# EAGLE design ueproj (EAGLE 8.2.1)
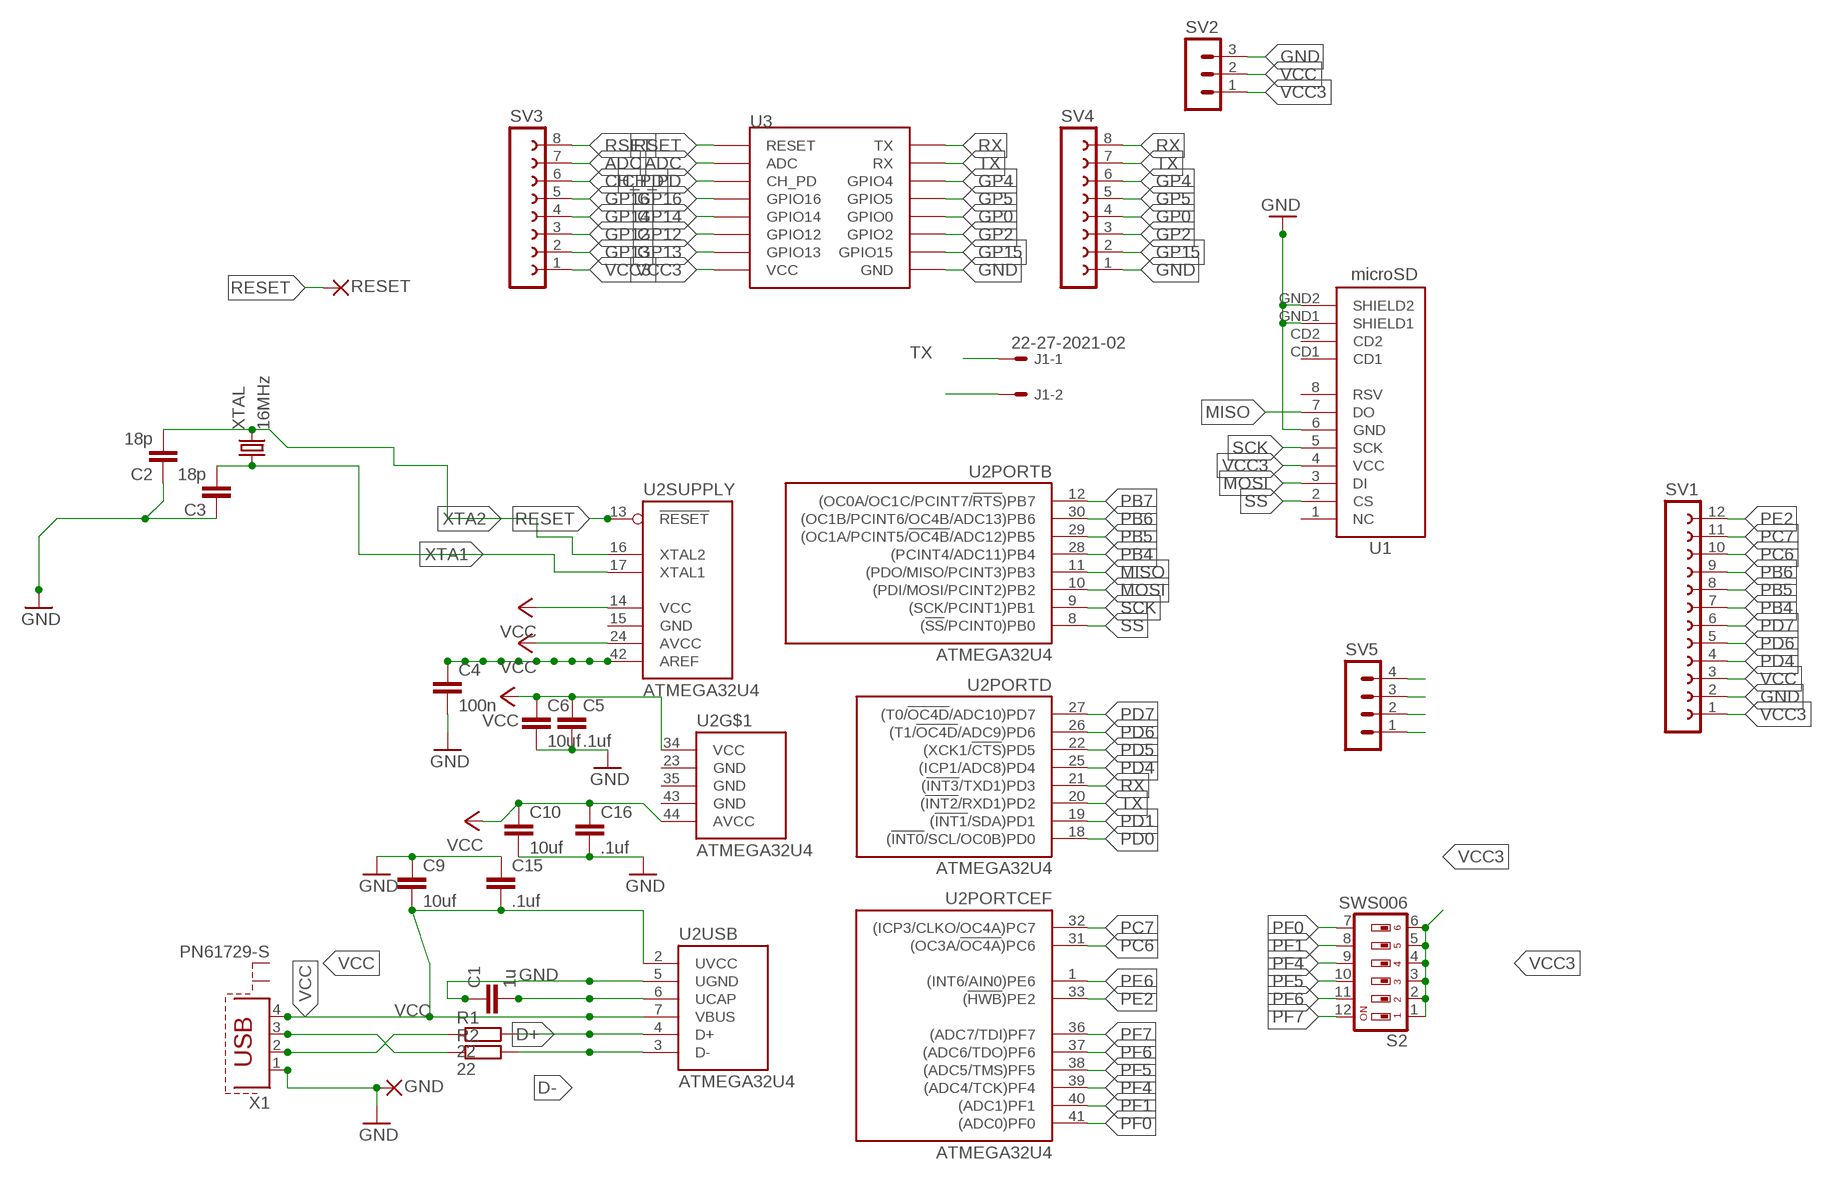
[diagram p0: schematic, sheet 1]

## Parts
C1  1u  C-EUC0603  [C0603]
C2  18p  C-EUC0603  [C0603]
C3  18p  C-EUC0603  [C0603]
C4  100n  C-EUC0603  [C0603]
C5  .1uf  C-EUC0603  [C0603]
C6  10uf  C2.5/2  [C2.5-2]
C9  10uf  C-EUC0603  [C0603]
C10  10uf  C2.5/2  [C2.5-2]
C15  .1uf  C-EUC0603  [C0603]
C16  .1uf  C-EUC0603  [C0603]
GND  WIREPAD2,15/1,0-NOPLACE  [2,15/1,0-NOPLACE]
J1  22-27-2021-02  [6410-02]
R1  22  R-EU_R0603  [R0603]
R2  22  R-EU_R0603  [R0603]
RESET  WIREPAD2,15/1,0-NOPLACE  [2,15/1,0-NOPLACE]
S2  SWS006  [SMS-006]
SV1  FE12-1  [FE12]
SV2  MA03-1  [MA03-1]
SV3  FE08-1  [FE08]
SV4  FE08-1  [FE08]
SV5  MA04-1  [MA04-1]
U1  microSD  USD-SOCKETSMD  [MICRO-SD-SOCKET-PP]
U2  ATMEGA32U4  ATMEGAXU4TQFP44  [TQFP44]
U3  ESP12SMD  [ESP12-SMD]
X1  PN61729-S  [PN61729-S]
XTAL  16MHz  CRYSTALABM7  [ABM7]

## Nets
ADC: SV3.7 U3.ADC
AREF: C4.1 U2.42(SUPPLY:AREF)
CH_PD: SV3.6 U3.CH_PD
D+: R1.2 U2.4(USB:D+)
D-: R2.2 U2.3(USB:D-)
GND: C1.1 C2.1 C3.1 C4.2 C10.2 C16.2 GND.1(P) SV1.2 SV2.3 SV4.1 U1.6(GND) U1.GND1(SHIELD1) U1.GND2(SHIELD2) U2.5(USB:UGND) U3.GND X1.1
GP0: SV4.4 U3.GPIO0
GP2: SV4.3 U3.GPIO2
GP4: SV4.6 U3.GPIO4
GP5: SV4.5 U3.GPIO5
GP12: SV3.3 U3.GPIO12
GP13: SV3.2 U3.GPIO13
GP14: SV3.4 U3.GPIO14
GP15: SV4.2 U3.GPIO15
GP16: SV3.5 U3.GPIO16
MISO: SV5.4 U1.7(DO) U2.11(PORTB:(PDO/MISO/PCINT3)PB3)
MOSI: SV5.2 U1.3(DI) U2.10(PORTB:(PDI/MOSI/PCINT2)PB2)
N$1: C9.1 C15.1
N$3: C5.2 C6.2
N$46: C1.2 U2.6(USB:UCAP)
N$74: R1.1 X1.2
N$75: R2.1 X1.3
PB4: SV1.7 U2.28(PORTB:(PCINT4/ADC11)PB4)
PB5: SV1.8 U2.29(PORTB:(OC1A/PCINT5/!OC4B!/ADC12)PB5)
PB6: SV1.9 U2.30(PORTB:(OC1B/PCINT6/OC4B/ADC13)PB6)
PB7: U2.12(PORTB:(OC0A/OC1C/PCINT7/!RTS!)PB7)
PC6: SV1.10 U2.31(PORTCEF:(OC3A/!OC4A!)PC6)
PC7: SV1.11 U2.32(PORTCEF:(ICP3/CLKO/OC4A)PC7)
PD0: U2.18(PORTD:(!INT0!/SCL/OC0B)PD0)
PD1: U2.19(PORTD:(!INT1!/SDA)PD1)
PD4: SV1.4 U2.25(PORTD:(ICP1/ADC8)PD4)
PD5: U2.22(PORTD:(XCK1/!CTS!)PD5)
PD6: SV1.5 U2.26(PORTD:(T1/!OC4D!/ADC9)PD6)
PD7: SV1.6 U2.27(PORTD:(T0/!OC4D!/ADC10)PD7)
PE2: SV1.12 U2.33(PORTCEF:(!HWB!)PE2)
PE6: U2.1(PORTCEF:(INT6/AIN0)PE6)
PF0: S2.7 U2.41(PORTCEF:(ADC0)PF0)
PF1: S2.8 U2.40(PORTCEF:(ADC1)PF1)
PF4: S2.9 U2.39(PORTCEF:(ADC4/TCK)PF4)
PF5: S2.10 U2.38(PORTCEF:(ADC5/TMS)PF5)
PF6: S2.11 U2.37(PORTCEF:(ADC6/TDO)PF6)
PF7: S2.12 U2.36(PORTCEF:(ADC7/TDI)PF7)
RESET: RESET.1(P) U2.13(SUPPLY:!RESET)
RSET: SV3.8 U3.RESET
RX: J1.2 SV4.8 U2.21(PORTD:(!INT3!/TXD1)PD3) U3.TXD0(TX)
SCK: SV5.3 U1.5(SCK) U2.9(PORTB:(SCK/PCINT1)PB1)
SS: SV5.1 U1.2(CS) U2.8(PORTB:(!SS!/PCINT0)PB0)
TX: J1.1 SV4.7 U2.20(PORTD:(!INT2!/RXD1)PD2) U3.RXD0(RX)
VCC: C5.1 C6.1 C9.2 C10.1 C15.2 C16.1 SV1.3 SV2.2 U2.2(USB:UVCC) U2.7(USB:VBUS) U2.14(SUPPLY:VCC) U2.24(SUPPLY:AVCC) U2.34(VCC) U2.44(AVCC) X1.4
VCC3: S2.1 S2.2 S2.3 S2.4 S2.5 S2.6 SV1.1 SV2.1 SV3.1 U1.4(VCC) U3.VCC
XTA1: C3.2 U2.17(SUPPLY:XTAL1) XTAL.P$1
XTA2: C2.2 U2.16(SUPPLY:XTAL2) XTAL.P$2
Unconnected: U1.1(NC) U1.8(RSV) U1.CD1 U1.CD2 X1.S1 X1.S2

## Power pins joined to a net without a drawn wire
GND: U2.15(SUPPLY:GND) U2.23(GND) U2.35(GND) U2.43(GND)

## Library data of the parts
C1-C5 C9 C15 C16 = rcl:C-EU: CAPACITOR, European symbol
C6 C10 = capacitor-wima:C: CAPACITOR naming: grid - package width
GND RESET = jocki:WIREPAD: Wire PAD connect wire on PCB
J1 = con-molex:22-?-02: CONNECTOR wire to board 2.54 mm (.1 inch) pitch header; OC_FARNELL: unknown; OC_NEWARK: unknown
R1 R2 = rcl:R-EU_: RESISTOR, European symbol
S2 = smd-special:SWS006: SMD Dip Switch 6 pol.
SV1 = con-lsta:FE12-1: FEMALE HEADER; OC_FARNELL: unknown; OC_NEWARK: unknown
SV2 = con-lstb:MA03-1: PIN HEADER; OC_FARNELL: unknown; OC_NEWARK: unknown
SV3 SV4 = con-lsta:FE08-1: FEMALE HEADER; OC_FARNELL: unknown; OC_NEWARK: unknown
SV5 = con-lstb:MA04-1: PIN HEADER; OC_FARNELL: unknown; OC_NEWARK: unknown
U1 = SparkFun:USD-SOCKET: microSD Socket Push-push type uSD socket. Schematic element and footprint production proven. Spark Fun Electronics SKU : PRT-00127. tDoc lines correctly indicate media card edge positions when inserting (unlocked, locked, depressed).
U2 = jocki:ATMEGAXU4: Atmel Atmega16U4 or Atmega32U4
U3 = esp8266modules:ESP12: ESP8266 Wifi module 12
X1 = con-berg:PN61729-S: BERG USB connector; OC_FARNELL: unknown; OC_NEWARK: unknown
XTAL = jocki:CRYSTAL

## Board
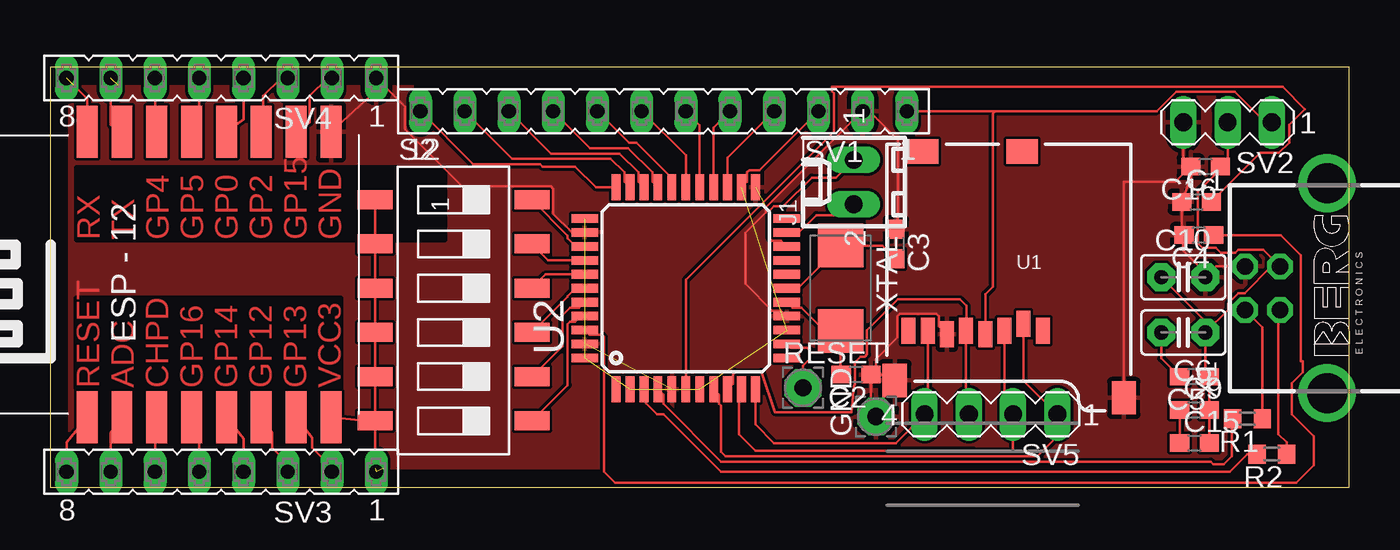
[diagram p1: board, top side]
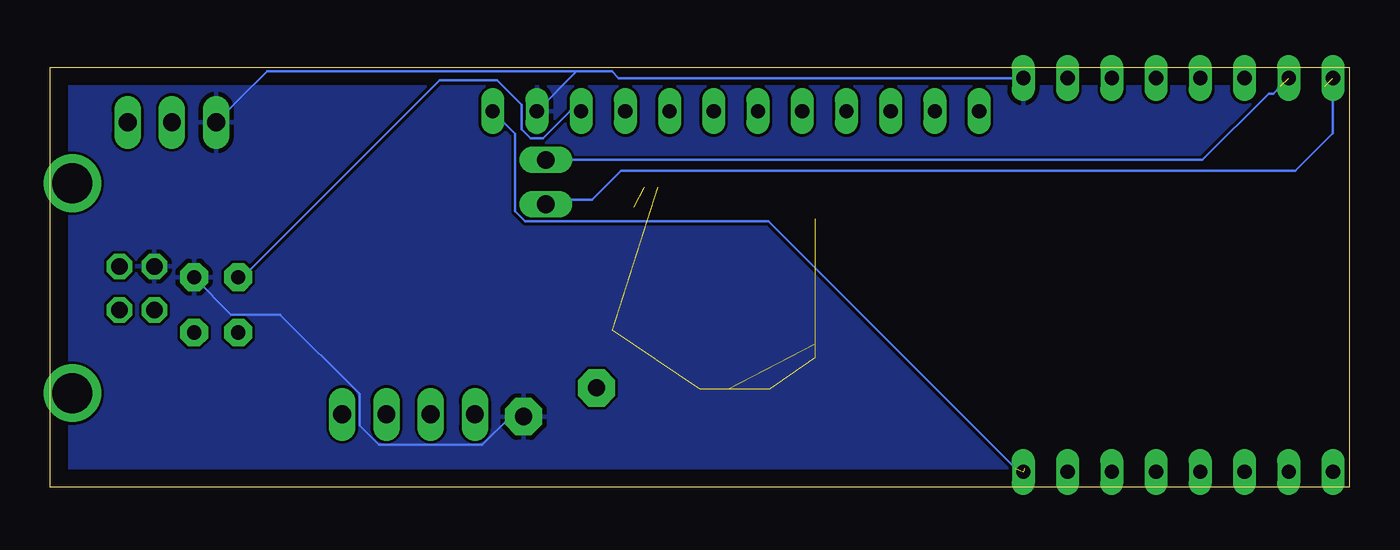
[diagram p2: board, bottom side, seen from below]

Size 74.6 x 24.11 mm. Coordinates in mm from the lower left corner, seen from the top.
Outline: 74.6,0 74.6,24.11 0,24.11 0,0 74.6,0
Copper layers (1*16): Top 0.035mm / dielectric 1.5mm / Bottom 0.035mm
Design rules "default": minimum track width 6mil, minimum drill 0.35mm, track to track 6mil, track to pad 6mil, pad to pad 6mil, via to via 6mil, smd to smd 6mil, copper to edge 40mil, drill to drill 6mil, minimum pad ring 10mil, minimum via ring 8mil, stop-mask expansion 4mil, vias tented up to drill 0mil, thermal gap 10mil

### Footprints (pad centres in the part's own frame; a part is rotated, then mirrored left to right if it is on the bottom)
C0603 = smd 1.1 x 1: 1 -0.85,0; 2 0.85,0
C2.5-2 = drill 0.813 pad 1.6 octagon: 1 -1.27,0; 2 1.27,0
2,15/1,0-NOPLACE = drill 1 pad 2.15 octagon: 1 0,0
6410-02 = drill 1.016 long: 1 1.27,0; 2 -1.27,0
R0603 = smd 1 x 1.1: 1 -0.85,0; 2 0.85,0
SMS-006 = smd 1.092 x 2.007: 1 -6.35,-4.496; 2 -3.81,-4.496; 3 -1.27,-4.496; 4 1.27,-4.496; 5 3.81,-4.496; 6 6.35,-4.496; 7 6.35,4.496; 8 3.81,4.496; 9 1.27,4.496; 10 -1.27,4.496; 11 -3.81,4.496; 12 -6.35,4.496
FE12 = drill 0.813 long: 1 -13.97,0; 2 -11.43,0; 3 -8.89,0; 4 -6.35,0; 5 -3.81,0; 6 -1.27,0; 7 1.27,0; 8 3.81,0; 9 6.35,0; 10 8.89,0; 11 11.43,0; 12 13.97,0
MA03-1 = drill 1.016 long: 1 -2.54,0; 2 0,0; 3 2.54,0
FE08 = drill 0.813 long: 1 -8.89,0; 2 -6.35,0; 3 -3.81,0; 4 -1.27,0; 5 1.27,0; 6 3.81,0; 7 6.35,0; 8 8.89,0
MA04-1 = drill 1.016 long: 1 -3.81,0; 2 -1.27,0; 3 1.27,0; 4 3.81,0
MICRO-SD-SOCKET-PP = smd 0.8 x 1.5: 1 -8.94,10.7; 2 -7.84,10.3; 3 -6.74,10.7; 4 -5.64,10.9; 5 -4.54,10.7; 6 -3.44,10.9; 7 -2.34,10.7; 8 -1.24,10.7 | smd 1.8 x 1.4: CD1 -7.75,0.4; CD2 -2.05,0.4 | smd 1.4 x 1.9: GND1 -13.6,14.55; GND2 -0.45,13.55
TQFP44 = smd 1.5 x 0.5: 1 -5.8,4; 2 -5.8,3.2; 3 -5.8,2.4; 4 -5.8,1.6; 5 -5.8,0.8; 6 -5.8,0; 7 -5.8,-0.8; 8 -5.8,-1.6; 9 -5.8,-2.4; 10 -5.8,-3.2; 11 -5.8,-4; 23 5.8,-4; 24 5.8,-3.2; 25 5.8,-2.4; 26 5.8,-1.6; 27 5.8,-0.8; 28 5.8,0; 29 5.8,0.8; 30 5.8,1.6; 31 5.8,2.4; 32 5.8,3.2; 33 5.8,4 | smd 0.5 x 1.5: 12 -4,-5.8; 13 -3.2,-5.8; 14 -2.4,-5.8; 15 -1.6,-5.8; 16 -0.8,-5.8; 17 0,-5.8; 18 0.8,-5.8; 19 1.6,-5.8; 20 2.4,-5.8; 21 3.2,-5.8; 22 4,-5.8; 34 4,5.8; 35 3.2,5.8; 36 2.4,5.8; 37 1.6,5.8; 38 0.8,5.8; 39 0,5.8; 40 -0.8,5.8; 41 -1.6,5.8; 42 -2.4,5.8; 43 -3.2,5.8; 44 -4,5.8
ESP12-SMD = smd 3 x 1.2: ADC -8.3,3.8; CH_PD -8.3,1.8; GND 8.1,-8.2; GPIO0 8.1,-2.2; GPIO2 8.1,-4.2; GPIO4 8.1,1.8; GPIO5 8.1,-0.2; GPIO12 -8.3,-4.2; GPIO13 -8.3,-6.2; GPIO14 -8.3,-2.2; GPIO15 8.1,-6.2; GPIO16 -8.3,-0.2; RESET -8.3,5.8; RXD0 8.1,3.8; TXD0 8.1,5.8; VCC -8.3,-8.2
PN61729-S = drill 0.95 octagon: 1 1.25,4.71; 2 -1.25,4.71; 3 -1.25,2.71; 4 1.25,2.71 | drill 2.3 pad 2.9: S1 -6.02,0; S2 6.02,0
ABM7 = smd 2.5 x 2.6: P$1 -2.45,0; P$2 2.45,0

### Placement (x,y rotation side)
C1  65.84,16.38 0 top
C2  46.28,6.48 180 top
C3  48.57,13.97 270 top
C4  65.96,14.48 180 top
C5  65.71,6.35 180 top
C6  65.08,8.89 180 top
C9  65.71,4.44 0 top
C10  65.08,12.06 0 top
C15  65.71,2.54 0 top
C16  66.34,18.41 180 top
GND  47.42,4.06 90 top
J1  46.15,17.53 90 top
R1  68.76,3.94 180 top
R2  70.16,1.9 180 top
RESET  43.23,5.71 0 top
S2  23.17,10.16 270 top
SV1  35.23,21.59 180 top
SV2  67.62,20.95 180 top
SV3  9.83,0.89 180 top
SV4  9.83,23.49 180 top
SV5  54.03,4.19 180 top
U1  48.06,19.69 180 top
U2  36.5,11.43 90 top
U3  7.93,12.32 90 top
X1  73.33,11.43 90 top
XTAL  45.39,11.43 270 top

### Tracks (layer width: path | path; a pad name or v marks a point on that pad's centre or on a via)
ADC
  Top 0.152: SV3.7 3.48,3.12 U3.ADC
AREF
  Top 0.152: C4.1 70.66,14.48 71.81,13.33 71.81,7.24 71.93,7.24 71.93,6.6 71.3,5.97 71.3,4.19 72.57,2.92 72.57,1.27 71.55,0.25 32.44,0.25 31.8,0.89 31.8,8.64 31.67,8.76 30.97,8.76 U2.42
CH_PD
  Top 0.152: SV3.6 6.02,3.66 U3.CH_PD
D+
  Top 0.152: U2.4 35.22,5.31 35.22,4.78 38.53,1.48 66.65,1.48 66.8,1.32 67.41,1.32 67.87,1.78 67.87,3.9 R1.2
D-
  Top 0.152: R2.2 68.76,1.9 67.74,0.89 38.53,0.89 35.23,4.19 34.85,4.19 34.21,4.83 34.21,5.52 U2.3
GND  (2 unrouted)
  Top 0.152: X1.1 66.96,12.68 C10.2 66.34,12.32 65.08,13.59 65.08,14.44 | C16.2 65.5,17.78 C1.1 64.99,14.53 65.08,14.44 | C16.2 65.08,18.84 SV2.3 | 65.08,14.44 C4.2 | U2.15 41.98,10.15 41.46,10.15 39.93,11.68 39.93,14.6 41.11,15.79 41.11,16.09 46.61,21.59 SV1.2 47.04,21.59 48.57,20.07 48.69,20.07 48.69,14.95 C3.1 | SV4.1 18.72,22.76 U3.GND | U2.35 29.97,14.63 28.89,15.71 28.89,17.15 28.76,17.28 23.65,17.28 20.37,20.56 20.37,21.84 19.2,23.02 | U1.GND1 61.66,17.54 64.62,17.54 C16.2 | U1.6 51.03,9.26 51.03,9.83 50.89,9.96 48.8,9.96 48.67,9.83 48.67,8.61 47.42,7.37 47.42,6.77 C2.1 | C2.1 47.13,4.36 GND.1 | C2.1 48.17,6.48 U1.GND2
  Bottom 0.152: SV4.1 41.96,23.49 42.34,23.88 44.37,23.88 | 44.37,23.88 SV1.2 | SV2.3 62.15,23.88 44.37,23.88 | C10.2 64.2,9.92 61.4,9.92 56.84,5.36 56.84,3.58 55.71,2.44 49.81,2.44 48.18,4.06 GND.1
  pour Top: 0.05,24.13 74.6,24.13 74.6,0 0.05,0
  pour Bottom: 0.05,24.13 74.6,24.13 74.6,0 0.05,0
GP0
  Top 0.152: SV4.4 11.1,21.14 U3.GPIO0
GP2
  Top 0.152: SV4.3 13.26,23.49 12.24,22.48 12.24,20.28 U3.GPIO2
GP4
  Top 0.152: SV4.6 6.02,20.27 U3.GPIO4
GP5
  Top 0.152: SV4.5 8.56,20.6 U3.GPIO5
GP12
  Top 0.152: SV3.3 13.64,1.4 12.75,2.29 12.75,3.14 U3.GPIO12
GP13
  Top 0.152: SV3.2 16.18,1.14 15.04,2.29 15.04,2.85 U3.GPIO13
GP14
  Top 0.152: SV3.4 11.1,2.79 U3.GPIO14
GP15
  Top 0.152: SV4.2 15.93,23.49 14.91,22.48 14.91,20.95 U3.GPIO15
GP16
  Top 0.152: SV3.5 8.56,3.33 U3.GPIO16
MISO
  Top 0.152: U1.7 50.4,4.37 SV5.4 48.57,2.54 41.58,2.54 40.5,3.62 U2.11
MOSI
  Top 0.152: U1.3 54.8,4.69 SV5.2 | SV5.2 55.17,4.19 | U2.10 39.55,5.48 39.55,3.05 40.51,2.09 53.07,2.09 53.12,2.03 55.3,2.03 SV5.2
N$1
  Top 0.152: C9.1 C15.1
N$3
  Top 0.152: C6.2 63.81,7.4 C5.2
N$46
  Top 0.152: U2.6 36.5,11.91 45.01,20.42 45.01,22.62 44.88,22.75 44.88,22.99 70.79,22.99 72.06,21.72 71.15,20.8 71.15,19.78 70.56,19.2 69.51,19.2 C1.2
N$74
  Top 0.152: X1.2 69.61,9.19 R1.1
N$75
  Top 0.152: R2.1 71,2.58 70.54,3.05 70.54,10.1 X1.3
PB4
  Top 0.152: SV1.7 36.5,19.05 U2.28
PB5
  Top 0.152: SV1.8 33.24,19.77 33.68,19.77 35.7,17.75 U2.29
PB6
  Top 0.152: SV1.9 31,19.47 33.18,19.47 34.58,18.08 34.58,17.55 U2.30
PC6
  Top 0.152: SV1.10 28.77,19.16 32.69,19.16 33.78,18.08 33.78,17.55 U2.31
PC7
  Top 0.152: SV1.11 26.53,18.86 32.19,18.86 32.98,18.08 32.98,17.55 U2.32
PD4
  Top 0.152: SV1.4 38.9,18.91 U2.25
PD6
  Top 0.152: SV1.5 38.1,20.65 U2.26
PD7
  Top 0.152: SV1.6 37.3,20.79 U2.27
PE2
  Top 0.152: SV1.12 24.3,18.55 28.12,18.55 28.26,18.41 30.15,18.41 31.34,17.23 U2.33
PF0
  Top 0.152: S2.7 29.72,5.87 29.72,9.37 29.86,9.51 30.13,9.51 30.46,9.83 U2.41
PF1
  Top 0.152: S2.8 29.42,8.11 29.42,9.87 29.86,10.31 30.38,10.31 U2.40
PF4
  Top 0.152: S2.9 29.72,10.95 29.72,10.97 30.18,11.43 U2.39
PF5
  Top 0.152: S2.10 28.46,12.23 U2.38
PF6
  Top 0.152: S2.11 28.6,13.03 U2.37
PF7
  Top 0.152: S2.12 29.72,14.45 29.72,14.28 30.18,13.83 U2.36
RESET
  Top 0.152: RESET.1 43.23,6.98 43.61,7.37 43.61,7.87 43.48,8 42.53,8 U2.13
RSET
  Top 0.152: SV3.8 0.94,2.58 U3.RESET
RX  (1 unrouted)
  Top 0.152: U3.TXD0 2.12,22.31 1.42,23.02 | U2.21 43,14.63 43.99,15.62 45.52,15.62 J1.2
  Bottom 0.152: SV4.8 0.94,20.32 3.1,18.16 41.83,18.16 43.48,16.51 45.9,16.51 J1.2
SCK
  Top 0.152: U2.9 39.22,5.95 39.22,6.47 39.36,6.61 40.84,6.61 41.61,4.32 46.03,4.32 46.15,5.83 46.21,5.88 46.21,7.18 46.53,7.5 46.79,7.5 46.92,7.63 46.92,9.02 48.69,10.79 52.25,10.79 52.63,10.41 52.63,9.02 U1.5 52.6,4.35 SV5.3
SS
  Top 0.152: U1.2 55.9,6.13 SV5.1 57.84,2.92 56.7,1.78 38.78,1.78 38.53,2.03 38.53,4.67 38.42,4.78 38.42,5.31 U2.8
TX  (1 unrouted)
  Top 0.152: SV4.7 3.48,20.81 U3.RXD0 | U2.20 41.98,14.15 41.46,14.15 41.32,14.28 41.32,15.87 41.58,16.13 42.09,16.13 43.74,17.78 45.14,17.78 J1.1
  Bottom 0.152: J1.1 8.43,18.8 4.62,22.61 4.37,22.61 3.96,23.02
VCC  (5 unrouted)
  Top 0.152: C6.1 67.66,10.21 67.66,10.58 68.22,11.14 68.59,11.14 70.14,12.68 X1.4 69.66,13.64 68.22,13.64 68.05,13.46 67.23,13.46 66.95,13.75 66.17,13.75 65.91,14.01 65.91,16.98 67.2,18.26 C16.1 67.62,18.84 SV2.2 | C6.1 66.34,9.53 C10.1 | C6.1 66.34,6.56 C5.1 C9.2 C15.2 | SV1.3 40.74,18.21 40.16,18.21 40.02,18.08 40.02,17.55 U2.24
  Bottom 0.152: C10.1 63.55,12.06 52.25,23.37 48.95,23.37 47.55,21.97 47.55,20.56 47.03,20.04 46.29,20.04 44.74,21.59 SV1.3
VCC3  (2 unrouted)
  Top 0.152: SV2.1 69.78,20.95 68.03,22.71 64.67,22.71 63.55,21.59 54.28,21.59 | 54.28,21.59 SV1.1 | U1.4 53.7,11.1 54.13,11.53 54.13,21.44 54.28,21.59 | 18.67,1.09 S2.6 | U3.VCC 18.62,3.76 S2.6 | S2.6 S2.5 S2.4 S2.3 S2.2 S2.1
  Bottom 0.152: 19.18,1.09 33.35,15.26 47.32,15.26 47.91,15.85 47.91,20.3 SV1.1
XTA1
  Top 0.152: U2.17 42.94,11.43 XTAL.P$1 47.8,13.88 C3.2
XTA2
  Top 0.152: U2.16 42.62,10.31 43.15,10.31 44.47,8.98 XTAL.P$2 45.39,6.52 C2.2

### Text on the board
Top: RX / TX / GP4 / GP5 / GP0 / GP2 / GP15 / GND | RESET / ADC / CHPD / GP16 / GP14 / GP12 / GP13 / VCC3